# Altium schematic sheet YUNFANGDIANLU.SCHDOC
size A4
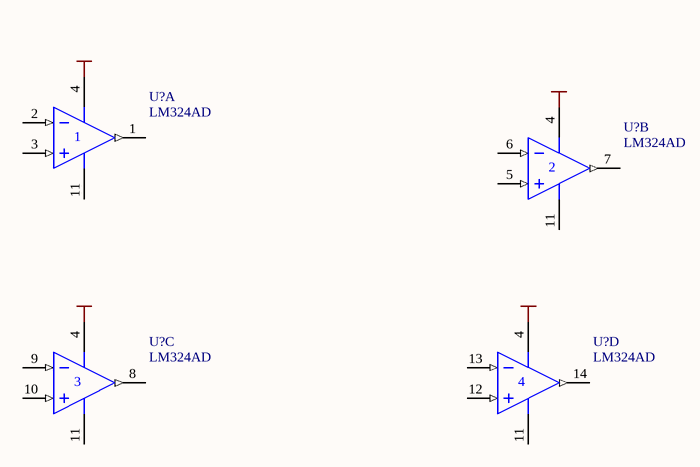
[diagram p0: YUNFANGDIANLU.SCHDOC]

## Parts
(Parts that share a designator on the sheet are numbered #1, #2 ... from top to bottom, then left to right.)
U?#1  LM324AD  [D014]  (part A of 4)
U?#2  LM324AD  [D014]  (part B of 4)
U?#3  LM324AD  [D014]  (part C of 4)
U?#4  LM324AD  [D014]  (part D of 4)

## Nets
+5: U?#1.4(V+) U?#2.4(V+) U?#3.4(V+) U?#4.4(V+)

Not connected (* = marked no-connect by the designer): U?#1 1(OUT) 2(IN-) 3(IN+) 11(V-); U?#2 5(IN+) 6(IN-) 7(OUT) 11(V-); U?#3 8(OUT) 9(IN-) 10(IN+) 11(V-); U?#4 11(V-) 12(IN+) 13(IN-) 14(OUT)

## Library data of the parts
U?#1-U?#4 = LM324AD: Quadruple Operational Amplifier; Published: 15-Apr-2002; LatestRevisionDate: 23-Sep-2002; LatestRevisionNote: PCB footprint, 'SO-G8/E2.5' replaced.; DatasheetDocument: Jan-1989; PackageDocument: Jan-1998; PackageReference: D014; Publisher: Altium Limited